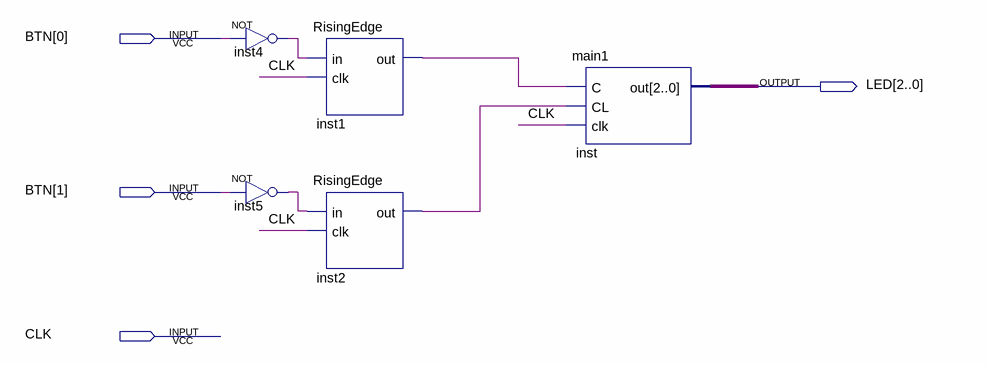
[diagram p0: schematic sheet]
// Quartus schematic test_main1.bdf as structural Verilog: 5 symbols, 4 pins
module test_main1 (
  input  [1:0] BTN,
  input  CLK,
  output [2:0] LED
);

  wire inst1_out, inst2_out, inst4_out, inst5_out;

  not inst4 (inst4_out, BTN[0]);
  not inst5 (inst5_out, BTN[1]);
  RisingEdge inst1 (.in(inst4_out), .clk(CLK), .out(inst1_out));
  RisingEdge inst2 (.in(inst5_out), .clk(CLK), .out(inst2_out));
  main1 inst (.C(inst1_out), .CL(inst2_out), .clk(CLK), .out(LED));
endmodule
